# Altium project E_stop.PrjPCB
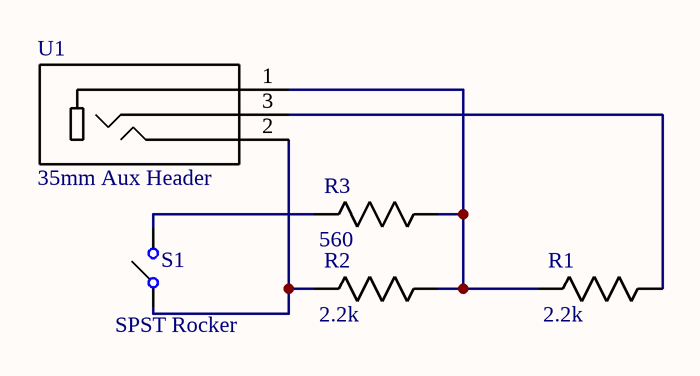
[diagram p0: EStop.SchDoc]
1 sheet, 5 parts. Net scope: global (net labels, ports and power ports of the same name join across sheets).
Board file: PCB1.PcbDoc

## Sheet EStop.SchDoc
size A4

### Parts
R1  2.2k  [RESC2013X65N]
R2  2.2k  [RESC2013X65N]
R3  560  [RESC2013X65N]
S1  SPST Rocker  [SWITCH ROCKER SPST 10A 125V]
U1  35mm Aux Header  [35mm Aux Header]

### Nets
NetR1_1: R1.1(R1) U1.3
NetR1_2: R1.2(R2) R2.1(R1) R3.1(R1) U1.1
NetR2_2: R2.2(R2) S1.0 U1.2
NetR3_2: R3.2(R2) S1.1

### Library data of the parts
R1 R2 = RES 2.2k 0805: RES SMD 2.2K OHM 1% 1/8W 0805; MP: RC0805FR-072K2L; MF: Yageo; Rating: 0.125W; Digikey: 311-2.20KCRCT-ND; Price: 0.15 CAD; Package: 0805; Value: 2.2k; Digikey Link: https://www.digikey.ca/product-detail/en/yageo/RC0805FR-072K2L/311-2.20KCRCT-ND/730623; Tolerance: 1%
R3 = RES 560 0805: RES 560 OHM 1% 1/8W 0805; MP: RMCF0805FT560R; MF: Stackpole Electronics Inc; Rating: 0.125W; Digikey: RMCF0805FT560RCT-ND; Price: 0.15 CAD; Package: 0805; Value: 560; Digikey Link: https://www.digikey.ca/product-detail/en/stackpole-electronics-inc/RMCF0805FT560R/RMCF0805FT560RCT-ND/2418431; Tolerance: 1%
S1 = SWITCH ROCKER SPST 10A 125V: Rocker Switch SPST 10A (AC) 125V Panel Mount, Snap-In; MP: SRB22A2FBBNN; MF: ZF Electronics; Digikey: CH755-ND; Digikey Link: https://www.digikey.ca/product-detail/en/zf-electronics/SRB22A2FBBNN/CH755-ND/446021; Price: 1.276 CAD; Rating: 10A 125V